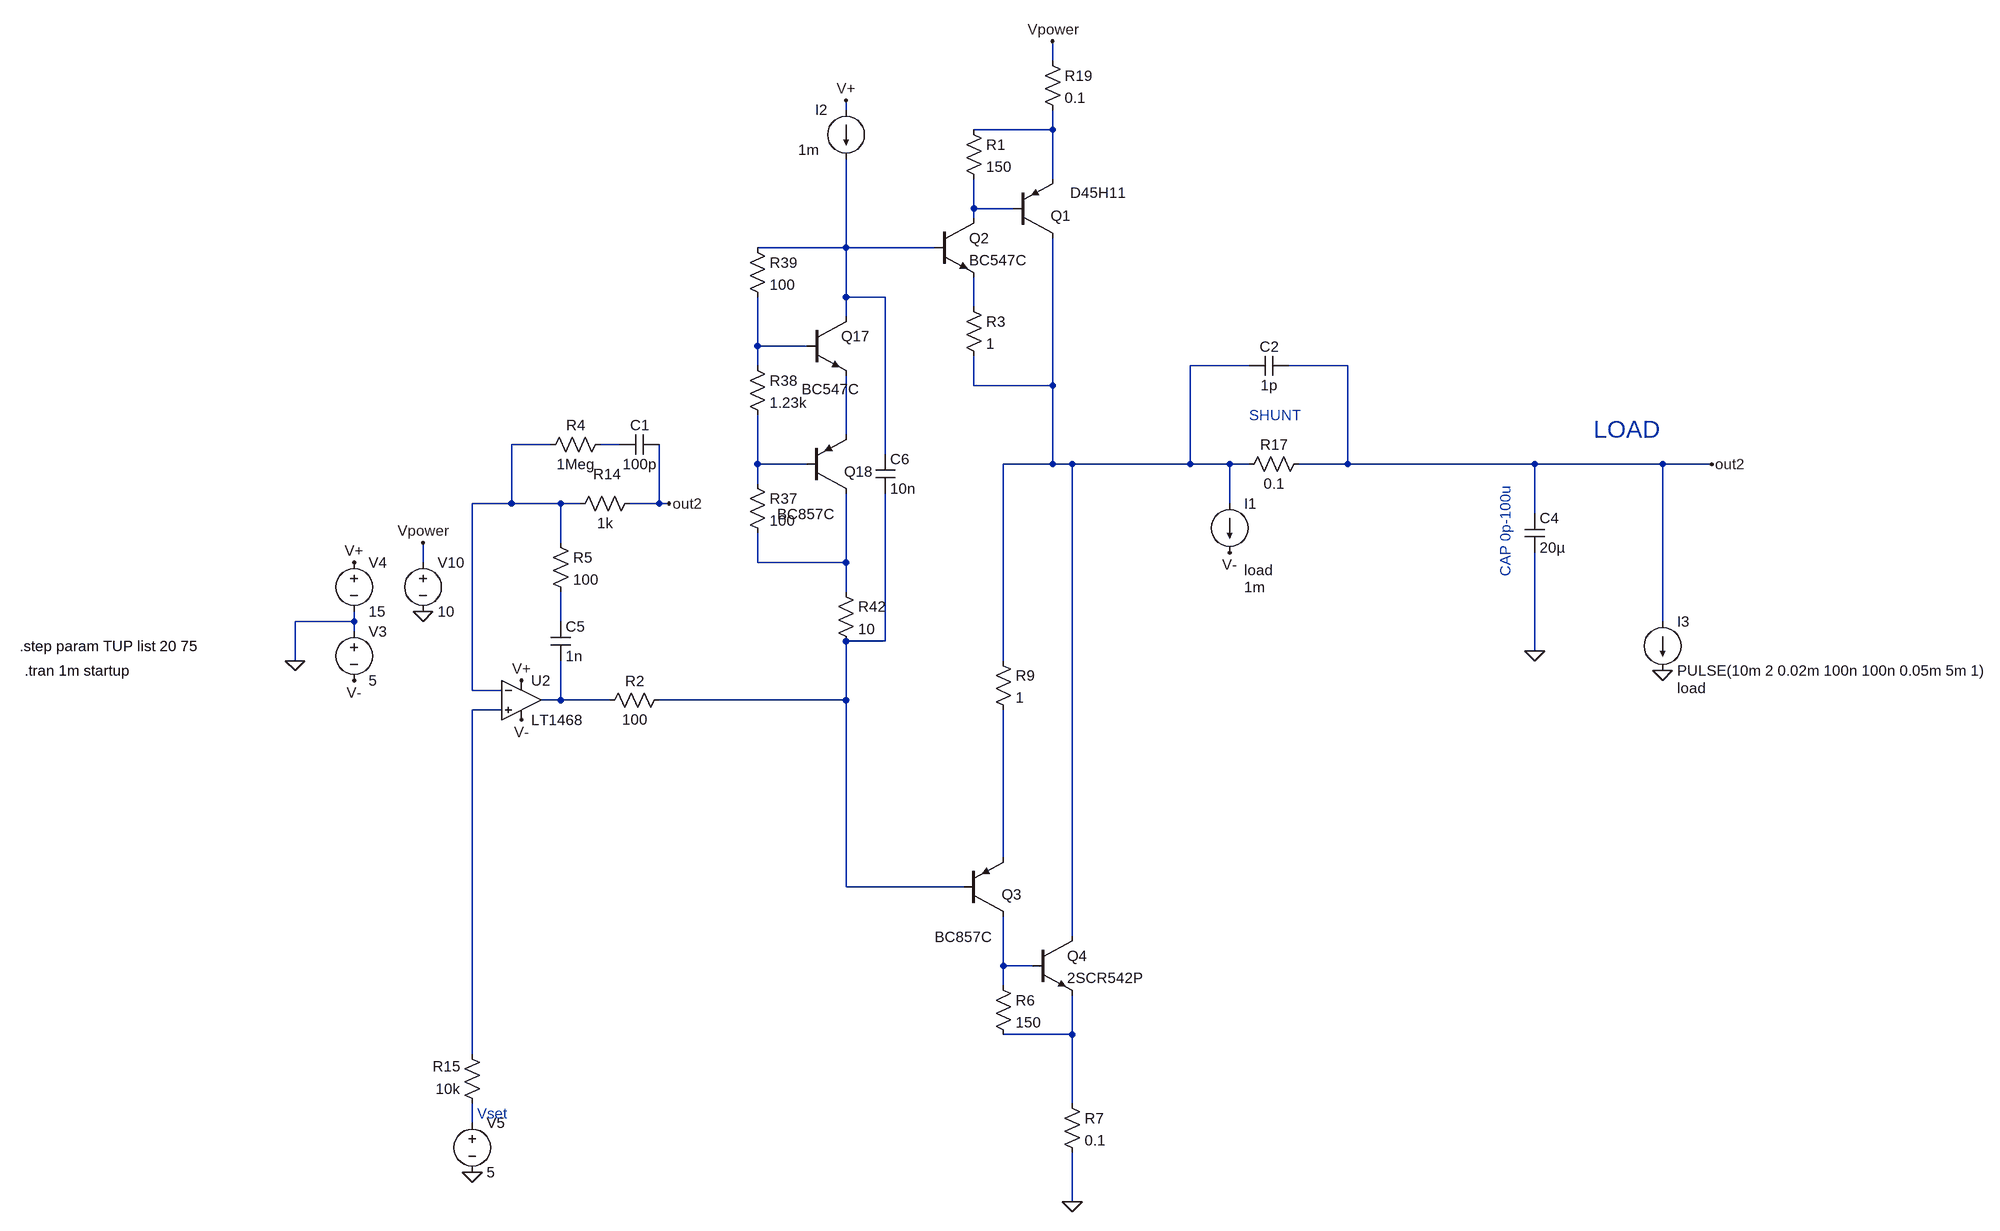
[diagram p0: schematic super_fast_push_pull_pass_export.asc]
super_fast_push_pull_pass_export.asc, the LTspice schematic file:
Version 4
SHEET 1 8456 1512
WIRE 432 -448 432 -480
WIRE 96 -368 96 -384
WIRE 432 -336 432 -368
WIRE 432 -336 304 -336
WIRE 432 -256 432 -336
WIRE 304 -208 304 -256
WIRE 368 -208 304 -208
WIRE 304 -192 304 -208
WIRE 96 -144 96 -288
WIRE 96 -144 -48 -144
WIRE 240 -144 96 -144
WIRE 96 -64 96 -144
WIRE 160 -64 96 -64
WIRE 304 -48 304 -96
WIRE 96 -32 96 -64
WIRE -48 16 -48 -64
WIRE 32 16 -48 16
WIRE -48 48 -48 16
WIRE 752 48 656 48
WIRE 912 48 816 48
WIRE 304 80 304 32
WIRE 432 80 432 -160
WIRE 432 80 304 80
WIRE 96 160 96 64
WIRE -384 176 -448 176
WIRE -272 176 -304 176
WIRE 160 192 160 -64
WIRE -48 208 -48 128
WIRE 32 208 -48 208
WIRE 432 208 432 80
WIRE 432 208 352 208
WIRE 464 208 432 208
WIRE 656 208 656 48
WIRE 656 208 464 208
WIRE 720 208 656 208
WIRE 752 208 720 208
WIRE 912 208 912 48
WIRE 912 208 832 208
WIRE 1216 208 912 208
WIRE 1424 208 1216 208
WIRE 1504 208 1424 208
WIRE -48 240 -48 208
WIRE -448 272 -448 176
WIRE -448 272 -512 272
WIRE -368 272 -448 272
WIRE -336 272 -368 272
WIRE -208 272 -208 176
WIRE -208 272 -256 272
WIRE -192 272 -208 272
WIRE 720 272 720 208
WIRE 1216 288 1216 208
WIRE -368 336 -368 272
WIRE -592 368 -592 336
WIRE -48 368 -48 320
WIRE 96 368 96 256
WIRE 96 368 -48 368
WIRE 96 416 96 368
WIRE -704 464 -704 448
WIRE -704 464 -800 464
WIRE -368 464 -368 416
WIRE 1424 464 1424 208
WIRE -704 480 -704 464
WIRE 160 496 160 256
WIRE 160 496 96 496
WIRE 1216 512 1216 352
WIRE -800 528 -800 464
WIRE 352 528 352 208
WIRE -512 576 -512 272
WIRE -464 576 -512 576
WIRE -368 592 -368 528
WIRE -368 592 -400 592
WIRE -288 592 -368 592
WIRE 96 592 96 496
WIRE 96 592 -208 592
WIRE -464 608 -512 608
WIRE 352 848 352 608
WIRE 96 896 96 592
WIRE 288 896 96 896
WIRE 464 976 464 208
WIRE 352 1024 352 944
WIRE 400 1024 352 1024
WIRE 352 1056 352 1024
WIRE 464 1136 464 1072
WIRE 464 1136 352 1136
WIRE -512 1168 -512 608
WIRE 464 1248 464 1136
WIRE -512 1280 -512 1248
WIRE 464 1408 464 1328
FLAG -800 528 0
FLAG -704 368 V+
FLAG -704 560 V-
FLAG -432 560 V+
FLAG -432 624 V-
FLAG 1504 208 out2
FLAG 1216 512 0
FLAG -512 1360 0
FLAG 720 352 V-
FLAG -192 272 out2
FLAG -592 336 Vpower
FLAG -592 448 0
FLAG 432 -480 Vpower
FLAG 96 -384 V+
FLAG 1424 544 0
FLAG 464 1408 0
DATAFLAG 1136 208 ""
SYMBOL voltage -704 464 R0
WINDOW 123 0 0 Left 0
WINDOW 39 0 0 Left 0
SYMATTR InstName V3
SYMATTR Value 5
SYMBOL voltage -704 352 R0
WINDOW 123 0 0 Left 0
WINDOW 39 0 0 Left 0
SYMATTR InstName V4
SYMATTR Value 15
SYMBOL cap -384 464 R0
SYMATTR InstName C5
SYMATTR Value 1n
SYMBOL res -240 256 R90
WINDOW 0 -16 53 VBottom 2
WINDOW 3 32 56 VTop 2
SYMATTR InstName R14
SYMATTR Value 1k
SYMBOL res -496 1264 R180
WINDOW 0 36 76 Left 2
WINDOW 3 36 40 Left 2
SYMATTR InstName R15
SYMATTR Value 10k
SYMBOL res 736 224 R270
WINDOW 0 32 56 VTop 2
WINDOW 3 0 56 VBottom 2
SYMATTR InstName R17
SYMATTR Value 0.1
SYMBOL cap 1200 288 R0
SYMATTR InstName C4
SYMATTR Value 20µ
SYMATTR SpiceLine Rser=0.1
SYMBOL voltage -512 1264 R0
WINDOW 123 0 0 Left 0
WINDOW 39 0 0 Left 0
SYMATTR InstName V5
SYMATTR Value 5
SYMBOL OpAmps\\LT1468 -432 528 R0
SYMATTR InstName U2
SYMBOL res -192 576 R90
WINDOW 0 0 56 VBottom 2
WINDOW 3 32 56 VTop 2
SYMATTR InstName R2
SYMATTR Value 100
SYMBOL current 720 272 R0
WINDOW 3 24 136 Left 2
WINDOW 123 0 0 Left 0
WINDOW 39 24 108 Left 2
SYMATTR Value 1m
SYMATTR SpiceLine load
SYMATTR InstName I1
SYMBOL voltage -592 352 R0
WINDOW 123 0 0 Left 0
WINDOW 39 0 0 Left 0
SYMATTR InstName V10
SYMATTR Value 10
SYMBOL res -384 320 R0
SYMATTR InstName R5
SYMATTR Value 100
SYMBOL current 96 -368 R0
WINDOW 0 -50 -1 Left 2
WINDOW 3 -78 64 Left 2
WINDOW 123 0 0 Left 0
WINDOW 39 0 0 Left 0
SYMATTR InstName I2
SYMATTR Value 1m
SYMBOL current 1424 464 R0
WINDOW 123 0 0 Left 0
WINDOW 39 24 108 Left 2
SYMATTR SpiceLine load
SYMATTR InstName I3
SYMATTR Value PULSE(10m 2 0.02m 100n 100n 0.05m 5m 1)
SYMBOL cap -208 160 R90
WINDOW 0 0 32 VBottom 2
WINDOW 3 32 32 VTop 2
SYMATTR InstName C1
SYMATTR Value 100p
SYMBOL res -288 160 R90
WINDOW 0 0 56 VBottom 2
WINDOW 3 32 56 VTop 2
SYMATTR InstName R4
SYMATTR Value 1Meg
SYMBOL cap 816 32 R90
WINDOW 0 0 32 VBottom 2
WINDOW 3 32 32 VTop 2
SYMATTR InstName C2
SYMATTR Value 1p
SYMBOL res 416 -464 R0
SYMATTR InstName R19
SYMATTR Value 0.1
SYMBOL npn 240 -192 R0
SYMATTR InstName Q2
SYMATTR Value BC547C
SYMATTR SpiceLine TEMP {TUP}
SYMBOL pnp 368 -160 M180
WINDOW 0 61 36 Left 2
WINDOW 3 93 74 Left 2
SYMATTR InstName Q1
SYMATTR Value D45H11
SYMBOL res 288 -352 R0
SYMATTR InstName R1
SYMATTR Value 150
SYMBOL res 288 -64 R0
SYMATTR InstName R3
SYMATTR Value 1
SYMBOL pnp 288 944 M180
WINDOW 0 61 36 Left 2
WINDOW 3 -48 -33 Left 2
SYMATTR InstName Q3
SYMATTR Value BC857C
SYMATTR SpiceLine TEMP {TUP}
SYMBOL npn 400 976 R0
SYMATTR InstName Q4
SYMATTR Value 2SCR542P
SYMBOL res 336 1040 R0
SYMATTR InstName R6
SYMATTR Value 150
SYMBOL res 448 1232 R0
SYMATTR InstName R7
SYMATTR Value 0.1
SYMBOL res 336 512 R0
SYMATTR InstName R9
SYMATTR Value 1
SYMBOL cap 144 192 R0
SYMATTR InstName C6
SYMATTR Value 10n
SYMBOL npn 32 -32 R0
WINDOW 3 -8 118 Left 2
SYMATTR Value BC547C
SYMATTR InstName Q17
SYMATTR SpiceLine TEMP {TUP}
SYMBOL pnp 32 256 M180
WINDOW 0 61 36 Left 2
WINDOW 3 -48 -33 Left 2
SYMATTR InstName Q18
SYMATTR Value BC857C
SYMATTR SpiceLine TEMP {TUP}
SYMBOL res -64 224 R0
SYMATTR InstName R37
SYMATTR Value 100
SYMBOL res -64 32 R0
SYMATTR InstName R38
SYMATTR Value 1.23k
SYMBOL res -64 -160 R0
SYMATTR InstName R39
SYMATTR Value 100
SYMBOL res 80 400 R0
SYMATTR InstName R42
SYMATTR Value 10
TEXT -504 1264 Left 2 ;Vset
TEXT 752 128 Left 2 ;SHUNT
TEXT 1312 152 Left 4 ;LOAD
TEXT 1168 392 VLeft 2 ;CAP 0p-100u
TEXT -1248 504 Left 2 !.step param TUP list 20 75
TEXT -1240 544 Left 2 !.tran 1m startup

The netlist it stands for:
* super_fast_push_pull_pass_export.asc
V3 0 V- 5
V4 V+ 0 15
C5 N012 N014 1n
R14 out2 N008 1k
R15 N019 N015 10k
R17 N006 out2 0.1
C4 out2 0 20µ Rser=0.1
V5 N019 0 5
XU2 N015 N008 V+ V- N014 LT1468  ; pins In+ In- V+ V- OUT
R2 N013 N014 100
I1 N006 V- 1m load
V10 Vpower 0 10
R5 N008 N012 100
I2 V+ N003 1m
I3 out2 0 PULSE(10m 2 0.02m 100n 100n 0.05m 5m 1) load
C1 out2 N009 100p
R4 N009 N008 1Meg
C2 out2 N006 1p
R19 Vpower N001 0.1
Q2 N002 N003 N004 0 BC547C TEMP {TUP}
Q1 N006 N002 N001 0 D45H11
R1 N001 N002 150
R3 N004 N006 1
Q3 N017 N013 N016 0 BC857C TEMP {TUP}
Q4 N006 N017 N018 0 2SCR542P
R6 N017 N018 150
R7 N018 0 0.1
R9 N006 N016 1
C6 N003 N013 10n
Q17 N003 N005 N007 0 BC547C TEMP {TUP}
Q18 N011 N010 N007 0 BC857C TEMP {TUP}
R37 N010 N011 100
R38 N005 N010 1.23k
R39 N003 N005 100
R42 N011 N013 10
.model NPN NPN
.model PNP PNP
.lib standard.bjt
* Vset
* SHUNT
* LOAD
* CAP 0p-100u
.step param TUP list 20 75
.tran 1m startup
.backanno
.end